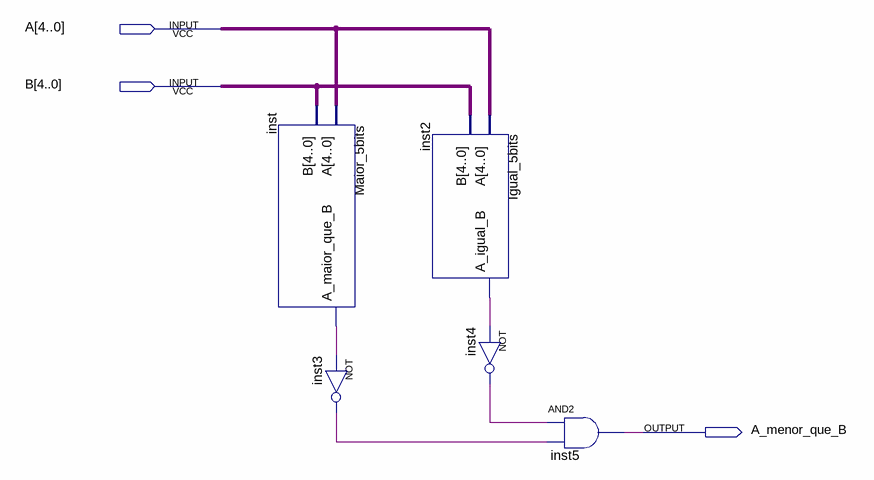
[diagram p0: schematic sheet]
// Quartus schematic Menor_5bits.bdf as structural Verilog: 5 symbols, 3 pins
module Menor_5bits (
  input  [4:0] A,
  input  [4:0] B,
  output A_menor_que_B
);

  wire inst2_a_igual_b, inst3_out, inst4_out, inst_a_maior_que_b;

  Maior_5bits inst (.A(A), .B(B), .A_maior_que_B(inst_a_maior_que_b));
  not inst3 (inst3_out, inst_a_maior_que_b);
  Igual_5bits inst2 (.A(A), .B(B), .A_igual_B(inst2_a_igual_b));
  not inst4 (inst4_out, inst2_a_igual_b);
  and inst5 (A_menor_que_B, inst4_out, inst3_out);
endmodule
